# EAGLE design Callisto_MSO_Teknic_v1p00 (EAGLE 9.6.2)
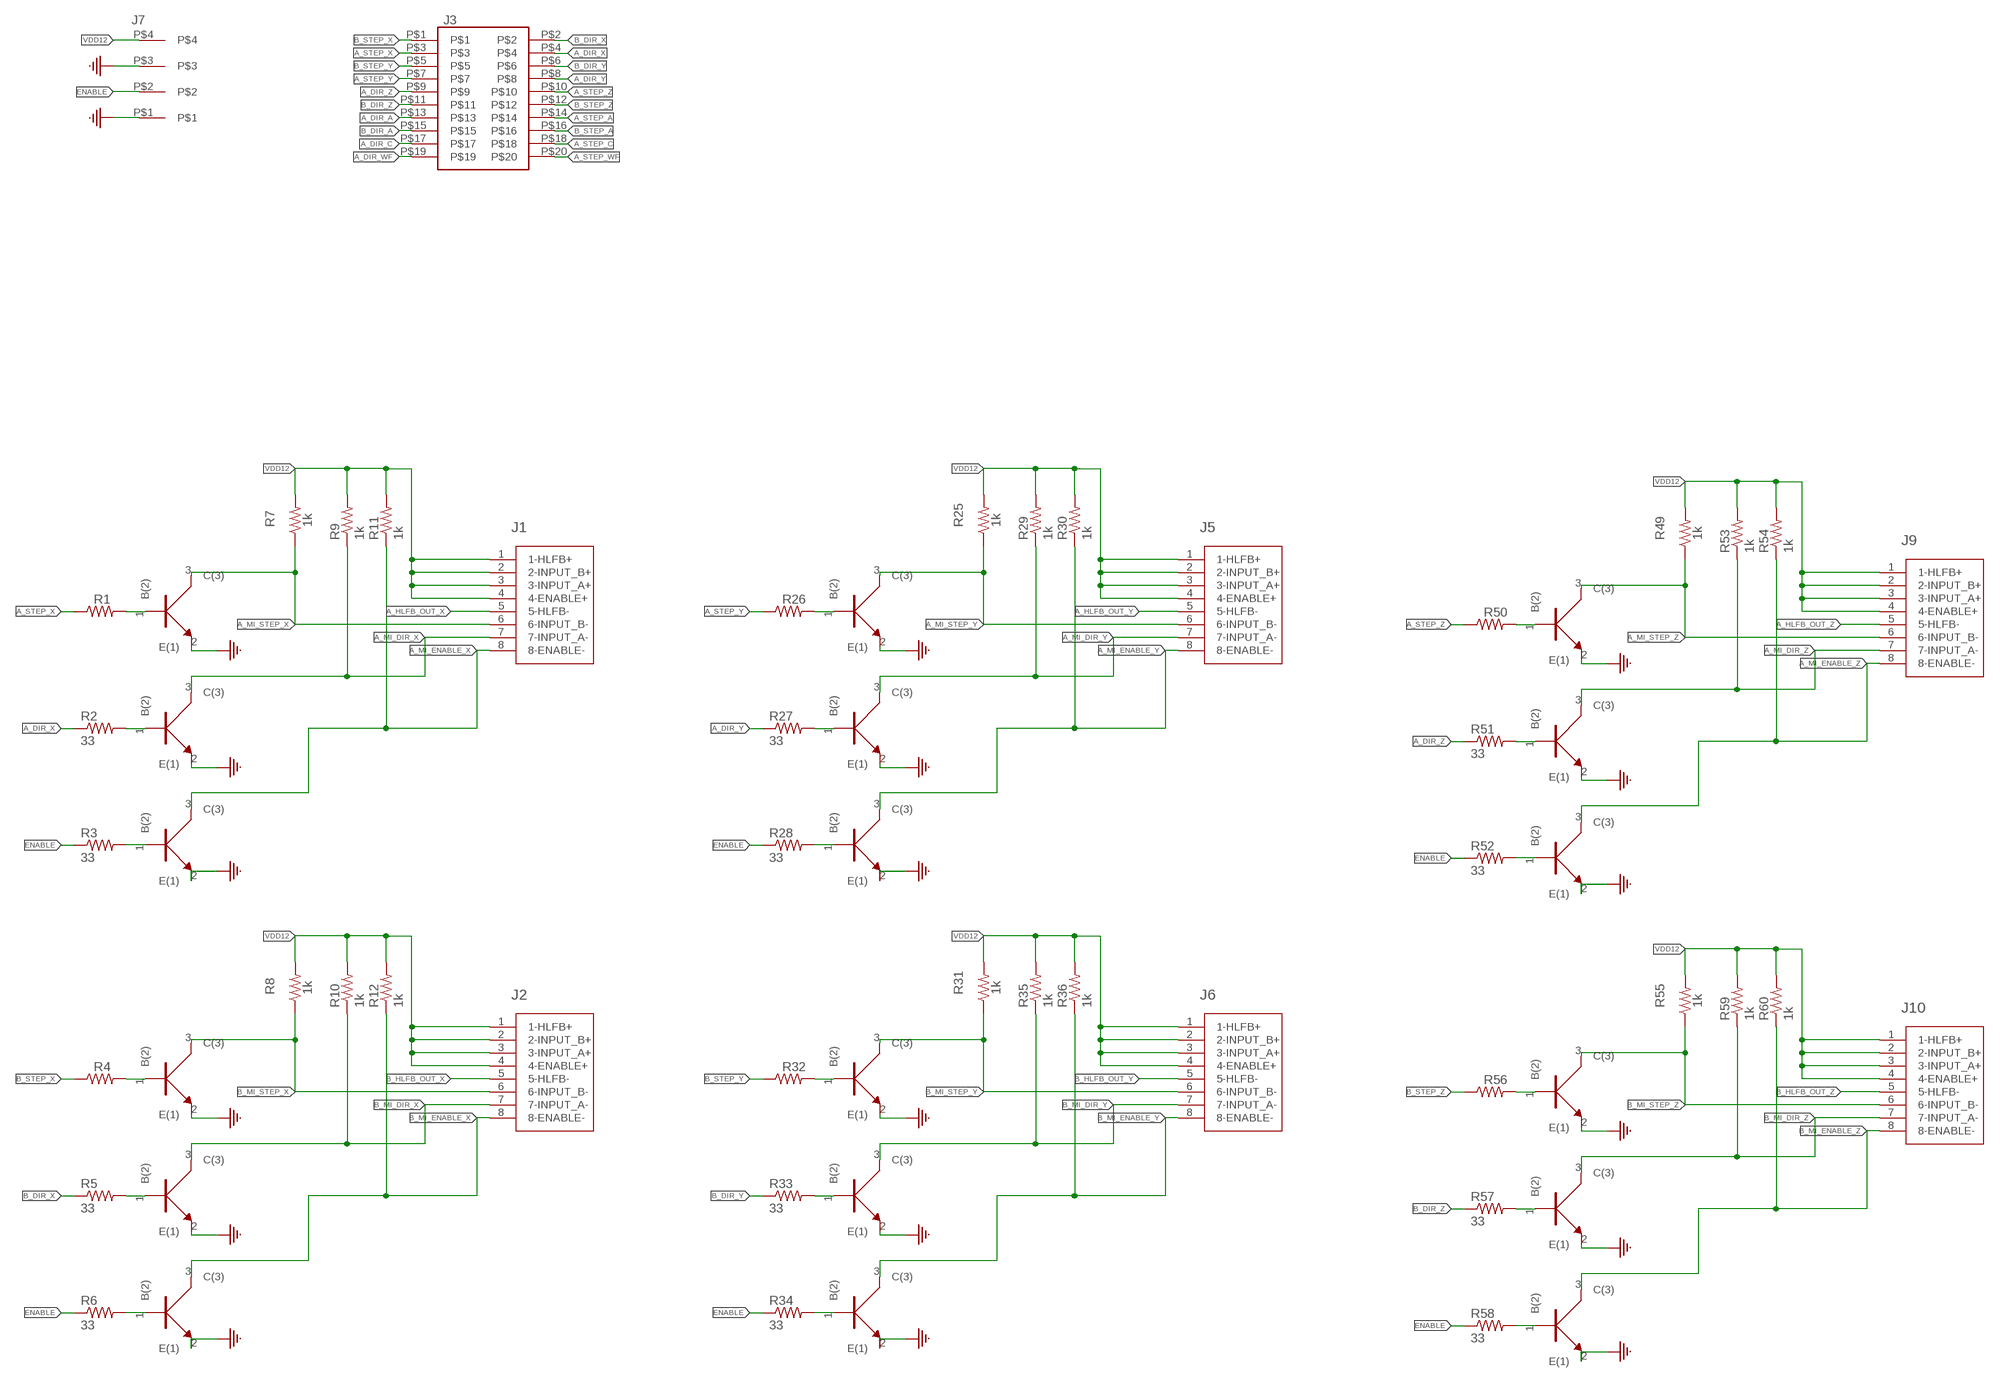
[diagram p0: schematic, sheet 1, part 1 of 2]
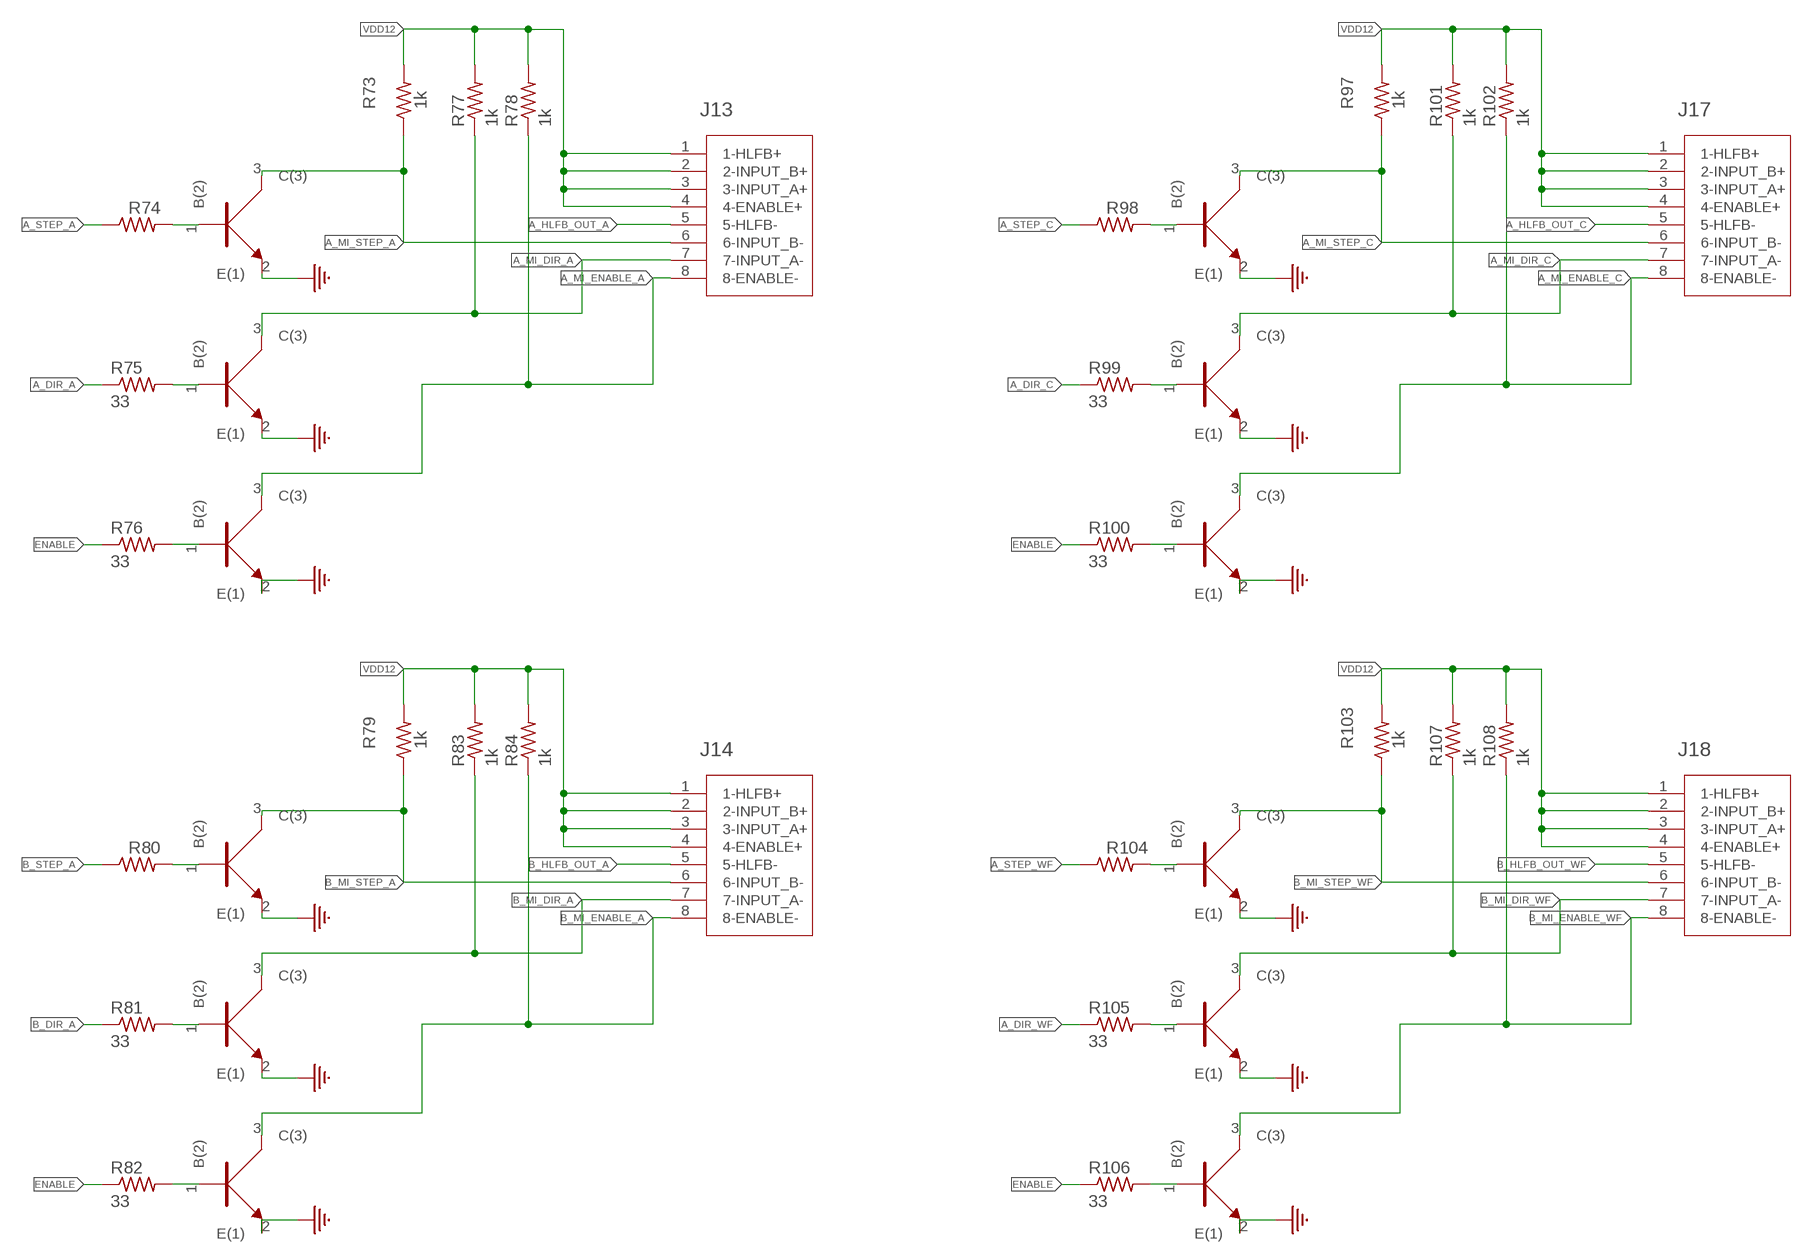
[diagram p1: schematic, sheet 1, part 2 of 2]

## Parts
J1  TEKNIC_8PIN_MOTOR  [CON_39281083]
J2  TEKNIC_8PIN_MOTOR  [CON_39281083]
J3  2_X_10_HEADER_GENERIC2_X_10_.1_IN_RA  [2_X_10_.1_INCH]
J5  TEKNIC_8PIN_MOTOR  [CON_39281083]
J6  TEKNIC_8PIN_MOTOR  [CON_39281083]
J7  4-pos  3.81MM_1_X_4_RT_ANGLE_PLUG_HEADER  [1X4_3.81MM_PITCH]
J9  TEKNIC_8PIN_MOTOR  [CON_39281083]
J10  TEKNIC_8PIN_MOTOR  [CON_39281083]
J13  TEKNIC_8PIN_MOTOR  [CON_39281083]
J14  TEKNIC_8PIN_MOTOR  [CON_39281083]
J17  TEKNIC_8PIN_MOTOR  [CON_39281083]
J18  TEKNIC_8PIN_MOTOR  [CON_39281083]
R1  33  R_0805  [0805]
R2  33  R_0805  [0805]
R3  33  R_0805  [0805]
R4  33  R_0805  [0805]
R5  33  R_0805  [0805]
R6  33  R_0805  [0805]
R7  1k  R_0805  [0805]
R8  1k  R_0805  [0805]
R9  1k  R_0805  [0805]
R10  1k  R_0805  [0805]
R11  1k  R_0805  [0805]
R12  1k  R_0805  [0805]
R25  1k  R_0805  [0805]
R26  33  R_0805  [0805]
R27  33  R_0805  [0805]
R28  33  R_0805  [0805]
R29  1k  R_0805  [0805]
R30  1k  R_0805  [0805]
R31  1k  R_0805  [0805]
R32  33  R_0805  [0805]
R33  33  R_0805  [0805]
R34  33  R_0805  [0805]
R35  1k  R_0805  [0805]
R36  1k  R_0805  [0805]
R49  1k  R_0805  [0805]
R50  33  R_0805  [0805]
R51  33  R_0805  [0805]
R52  33  R_0805  [0805]
R53  1k  R_0805  [0805]
R54  1k  R_0805  [0805]
R55  1k  R_0805  [0805]
R56  33  R_0805  [0805]
R57  33  R_0805  [0805]
R58  33  R_0805  [0805]
R59  1k  R_0805  [0805]
R60  1k  R_0805  [0805]
R73  1k  R_0805  [0805]
R74  33  R_0805  [0805]
R75  33  R_0805  [0805]
R76  33  R_0805  [0805]
R77  1k  R_0805  [0805]
R78  1k  R_0805  [0805]
R79  1k  R_0805  [0805]
R80  33  R_0805  [0805]
R81  33  R_0805  [0805]
R82  33  R_0805  [0805]
R83  1k  R_0805  [0805]
R84  1k  R_0805  [0805]
R97  1k  R_0805  [0805]
R98  33  R_0805  [0805]
R99  33  R_0805  [0805]
R100  33  R_0805  [0805]
R101  1k  R_0805  [0805]
R102  1k  R_0805  [0805]
R103  1k  R_0805  [0805]
R104  33  R_0805  [0805]
R105  33  R_0805  [0805]
R106  33  R_0805  [0805]
R107  1k  R_0805  [0805]
R108  1k  R_0805  [0805]
U1  NPN  BC846BW  [SOT323]
U2  NPN  BC846BW  [SOT323]
U3  NPN  BC846BW  [SOT323]
U4  NPN  BC846BW  [SOT323]
U5  NPN  BC846BW  [SOT323]
U6  NPN  BC846BW  [SOT323]
U13  NPN  BC846BW  [SOT323]
U14  NPN  BC846BW  [SOT323]
U15  NPN  BC846BW  [SOT323]
U16  NPN  BC846BW  [SOT323]
U17  NPN  BC846BW  [SOT323]
U18  NPN  BC846BW  [SOT323]
U25  NPN  BC846BW  [SOT323]
U26  NPN  BC846BW  [SOT323]
U27  NPN  BC846BW  [SOT323]
U28  NPN  BC846BW  [SOT323]
U29  NPN  BC846BW  [SOT323]
U30  NPN  BC846BW  [SOT323]
U37  NPN  BC846BW  [SOT323]
U38  NPN  BC846BW  [SOT323]
U39  NPN  BC846BW  [SOT323]
U40  NPN  BC846BW  [SOT323]
U41  NPN  BC846BW  [SOT323]
U42  NPN  BC846BW  [SOT323]
U49  NPN  BC846BW  [SOT323]
U50  NPN  BC846BW  [SOT323]
U51  NPN  BC846BW  [SOT323]
U52  NPN  BC846BW  [SOT323]
U53  NPN  BC846BW  [SOT323]
U54  NPN  BC846BW  [SOT323]

## Nets
A_DIR_A: J3.P$13 R75.1
A_DIR_C: J3.P$17 R99.1
A_DIR_WF: J3.P$19 R105.1
A_DIR_X: J3.P$4 R2.1
A_DIR_Y: J3.P$8 R27.1
A_DIR_Z: J3.P$9 R51.1
A_HLFB_OUT_A: J13.5(5-HLFB-)
A_HLFB_OUT_C: J17.5(5-HLFB-)
A_HLFB_OUT_X: J1.5(5-HLFB-)
A_HLFB_OUT_Y: J5.5(5-HLFB-)
A_HLFB_OUT_Z: J9.5(5-HLFB-)
A_MI_DIR_A: J13.7(7-INPUT_A-) R77.1 U38.3(C(3))
A_MI_DIR_C: J17.7(7-INPUT_A-) R101.1 U50.3(C(3))
A_MI_DIR_X: J1.7(7-INPUT_A-) R9.1 U2.3(C(3))
A_MI_DIR_Y: J5.7(7-INPUT_A-) R29.1 U14.3(C(3))
A_MI_DIR_Z: J9.7(7-INPUT_A-) R53.1 U26.3(C(3))
A_MI_ENABLE_A: J13.8(8-ENABLE-) R78.1 U39.3(C(3))
A_MI_ENABLE_C: J17.8(8-ENABLE-) R102.1 U51.3(C(3))
A_MI_ENABLE_X: J1.8(8-ENABLE-) R11.1 U3.3(C(3))
A_MI_ENABLE_Y: J5.8(8-ENABLE-) R30.1 U15.3(C(3))
A_MI_ENABLE_Z: J9.8(8-ENABLE-) R54.1 U27.3(C(3))
A_MI_STEP_A: J13.6(6-INPUT_B-) R73.1 U37.3(C(3))
A_MI_STEP_C: J17.6(6-INPUT_B-) R97.1 U49.3(C(3))
A_MI_STEP_X: J1.6(6-INPUT_B-) R7.1 U1.3(C(3))
A_MI_STEP_Y: J5.6(6-INPUT_B-) R25.1 U13.3(C(3))
A_MI_STEP_Z: J9.6(6-INPUT_B-) R49.1 U25.3(C(3))
A_STEP_A: J3.P$14 R74.1
A_STEP_C: J3.P$18 R98.1
A_STEP_WF: J3.P$20 R104.1
A_STEP_X: J3.P$3 R1.1
A_STEP_Y: J3.P$7 R26.1
A_STEP_Z: J3.P$10 R50.1
B_DIR_A: J3.P$15 R81.1
B_DIR_X: J3.P$2 R5.1
B_DIR_Y: J3.P$6 R33.1
B_DIR_Z: J3.P$11 R57.1
B_HLFB_OUT_A: J14.5(5-HLFB-)
B_HLFB_OUT_WF: J18.5(5-HLFB-)
B_HLFB_OUT_X: J2.5(5-HLFB-)
B_HLFB_OUT_Y: J6.5(5-HLFB-)
B_HLFB_OUT_Z: J10.5(5-HLFB-)
B_MI_DIR_A: J14.7(7-INPUT_A-) R83.1 U41.3(C(3))
B_MI_DIR_WF: J18.7(7-INPUT_A-) R107.1 U53.3(C(3))
B_MI_DIR_X: J2.7(7-INPUT_A-) R10.1 U5.3(C(3))
B_MI_DIR_Y: J6.7(7-INPUT_A-) R35.1 U17.3(C(3))
B_MI_DIR_Z: J10.7(7-INPUT_A-) R59.1 U29.3(C(3))
B_MI_ENABLE_A: J14.8(8-ENABLE-) R84.1 U42.3(C(3))
B_MI_ENABLE_WF: J18.8(8-ENABLE-) R108.1 U54.3(C(3))
B_MI_ENABLE_X: J2.8(8-ENABLE-) R12.1 U6.3(C(3))
B_MI_ENABLE_Y: J6.8(8-ENABLE-) R36.1 U18.3(C(3))
B_MI_ENABLE_Z: J10.8(8-ENABLE-) R60.1 U30.3(C(3))
B_MI_STEP_A: J14.6(6-INPUT_B-) R79.1 U40.3(C(3))
B_MI_STEP_WF: J18.6(6-INPUT_B-) R103.1 U52.3(C(3))
B_MI_STEP_X: J2.6(6-INPUT_B-) R8.1 U4.3(C(3))
B_MI_STEP_Y: J6.6(6-INPUT_B-) R31.1 U16.3(C(3))
B_MI_STEP_Z: J10.6(6-INPUT_B-) R55.1 U28.3(C(3))
B_STEP_A: J3.P$16 R80.1
B_STEP_X: J3.P$1 R4.1
B_STEP_Y: J3.P$5 R32.1
B_STEP_Z: J3.P$12 R56.1
ENABLE: J7.P$2 R3.1 R6.1 R28.1 R34.1 R52.1 R58.1 R76.1 R82.1 R100.1 R106.1
GND: J7.P$1 J7.P$3 U1.2(E(1)) U2.2(E(1)) U3.2(E(1)) U4.2(E(1)) U5.2(E(1)) U6.2(E(1)) U13.2(E(1)) U14.2(E(1)) U15.2(E(1)) U16.2(E(1)) U17.2(E(1)) U18.2(E(1)) U25.2(E(1)) U26.2(E(1)) U27.2(E(1)) U28.2(E(1)) U29.2(E(1)) U30.2(E(1)) U37.2(E(1)) U38.2(E(1)) U39.2(E(1)) U40.2(E(1)) U41.2(E(1)) U42.2(E(1)) U49.2(E(1)) U50.2(E(1)) U51.2(E(1)) U52.2(E(1)) U53.2(E(1)) U54.2(E(1))
N$1: R2.2 U2.1(B(2))
N$2: R1.2 U1.1(B(2))
N$4: R3.2 U3.1(B(2))
N$7: R5.2 U5.1(B(2))
N$8: R6.2 U6.1(B(2))
N$9: R4.2 U4.1(B(2))
N$13: R27.2 U14.1(B(2))
N$14: R28.2 U15.1(B(2))
N$15: R26.2 U13.1(B(2))
N$16: R33.2 U17.1(B(2))
N$17: R34.2 U18.1(B(2))
N$18: R32.2 U16.1(B(2))
N$25: R51.2 U26.1(B(2))
N$26: R52.2 U27.1(B(2))
N$27: R50.2 U25.1(B(2))
N$28: R57.2 U29.1(B(2))
N$29: R58.2 U30.1(B(2))
N$30: R56.2 U28.1(B(2))
N$37: R75.2 U38.1(B(2))
N$38: R76.2 U39.1(B(2))
N$39: R74.2 U37.1(B(2))
N$40: R81.2 U41.1(B(2))
N$41: R82.2 U42.1(B(2))
N$42: R80.2 U40.1(B(2))
N$49: R99.2 U50.1(B(2))
N$50: R100.2 U51.1(B(2))
N$51: R98.2 U49.1(B(2))
N$52: R105.2 U53.1(B(2))
N$53: R106.2 U54.1(B(2))
N$54: R104.2 U52.1(B(2))
VDD12: J1.1(1-HLFB+) J1.2(2-INPUT_B+) J1.3(3-INPUT_A+) J1.4(4-ENABLE+) J2.1(1-HLFB+) J2.2(2-INPUT_B+) J2.3(3-INPUT_A+) J2.4(4-ENABLE+) J5.1(1-HLFB+) J5.2(2-INPUT_B+) J5.3(3-INPUT_A+) J5.4(4-ENABLE+) J6.1(1-HLFB+) J6.2(2-INPUT_B+) J6.3(3-INPUT_A+) J6.4(4-ENABLE+) J7.P$4 J9.1(1-HLFB+) J9.2(2-INPUT_B+) J9.3(3-INPUT_A+) J9.4(4-ENABLE+) J10.1(1-HLFB+) J10.2(2-INPUT_B+) J10.3(3-INPUT_A+) J10.4(4-ENABLE+) J13.1(1-HLFB+) J13.2(2-INPUT_B+) J13.3(3-INPUT_A+) J13.4(4-ENABLE+) J14.1(1-HLFB+) J14.2(2-INPUT_B+) J14.3(3-INPUT_A+) J14.4(4-ENABLE+) J17.1(1-HLFB+) J17.2(2-INPUT_B+) J17.3(3-INPUT_A+) J17.4(4-ENABLE+) J18.1(1-HLFB+) J18.2(2-INPUT_B+) J18.3(3-INPUT_A+) J18.4(4-ENABLE+) R7.2 R8.2 R9.2 R10.2 R11.2 R12.2 R25.2 R29.2 R30.2 R31.2 R35.2 R36.2 R49.2 R53.2 R54.2 R55.2 R59.2 R60.2 R73.2 R77.2 R78.2 R79.2 R83.2 R84.2 R97.2 R101.2 R102.2 R103.2 R107.2 R108.2

## Library data of the parts
J1 J2 J5 J6 J9 J10 J13 J14 J17 J18 = 3D_MIG_Controller:TEKNIC_8PIN_MOTOR; COPYRIGHT: Copyright (C) 2022 Ultra Librarian. All rights reserved.; MANUFACTURER_PART_NUMBER: 39281083; MFR_NAME: Molex Connector Corporation
J3 = 3D_MIG_Controller:2_X_10_HEADER_GENERIC: CONN HEADER R/A 20POS 2.54MM, Straight, Right Angle; PARTNO: PH2RA-20-UA
J7 = 3D_MIG_Controller:3.81MM_1_X_4_RT_ANGLE_PLUG_HEADER: 4 Position Terminal Block Header, Male Pins, Shrouded (4 Side) 0.150" (3.81mm) 90°, Right Angle - Through Hole; PARTNO: 691322310004
R1-R12 R25-R36 R49-R60 R73-R84 R97-R108 = 3D_MIG_Controller:R_0805
U1-U6 U13-U18 U25-U30 U37-U42 U49-U54 = 3D_MIG_Controller:BC846BW: Bipolar (BJT) Transistor NPN 100MHz Surface Mount SOT-323; PARTNO: BC846BW_NPN

## Board
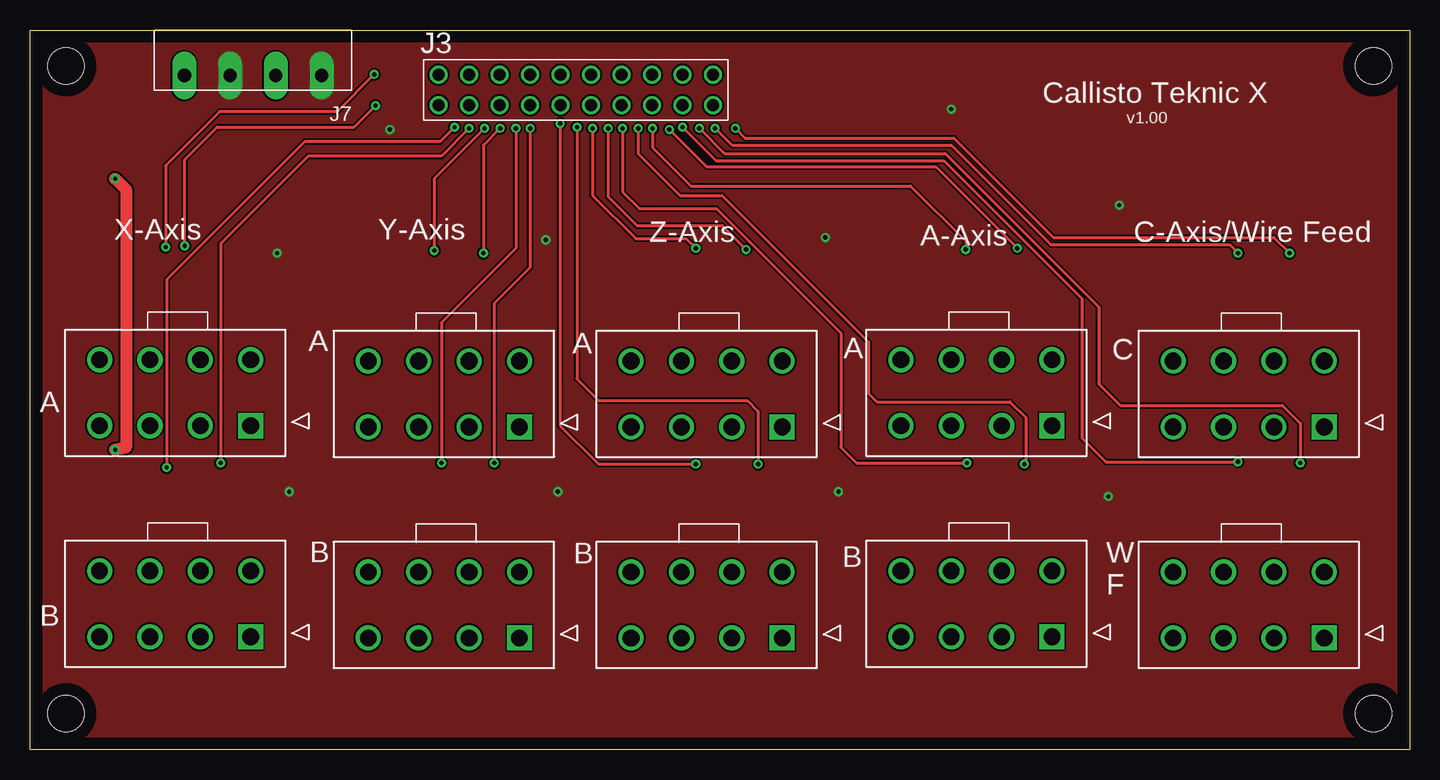
[diagram p2: board, top side]
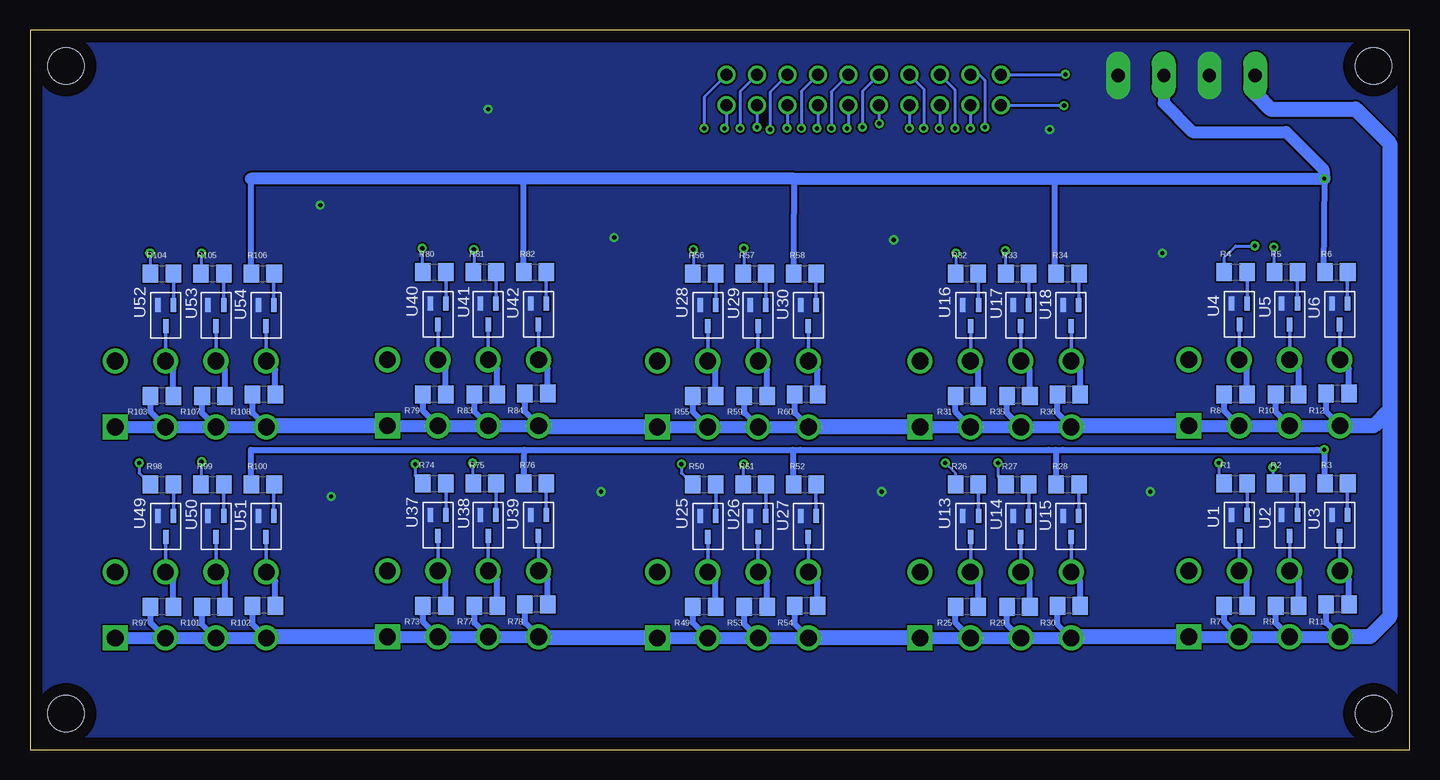
[diagram p3: board, bottom side, seen from below]

Size 115 x 60 mm. Coordinates in mm from the lower left corner, seen from the top.
Outline: 0,0 0,60 115,60 115,0 0,0
Copper layers (1*16): Top 0.035mm / dielectric 1.5mm / Bottom 0.035mm
Design rules "default": minimum track width 6mil, minimum drill 0.35mm, track to track 6mil, track to pad 6mil, pad to pad 6mil, via to via 6mil, smd to smd 6mil, copper to edge 40mil, drill to drill 6mil, minimum pad ring 10mil, minimum via ring 8mil, stop-mask expansion 4mil, vias tented up to drill 0mil, thermal gap 10mil
Holes 3 mm at 3,57 3,3 112,3 112,57

### Footprints (pad centres in the part's own frame; a part is rotated, then mirrored left to right if it is on the bottom)
CON_39281083 = drill 1.397 pad 1.905 square: 1 12.6,-5.5 | drill 1.397 pad 1.905: 2 8.4,-5.5; 3 4.2,-5.5; 4 0,-5.5; 5 12.6,0; 6 8.4,0; 7 4.2,0; 8 0,0
2_X_10_.1_INCH = drill 1: P$1 -11.43,-1.27; P$2 -11.43,1.27; P$3 -8.89,-1.27; P$4 -8.89,1.27; P$5 -6.35,-1.27; P$6 -6.35,1.27; P$7 -3.81,-1.27; P$8 -3.81,1.27; P$9 -1.27,-1.27; P$10 -1.27,1.27; P$11 1.27,-1.27; P$12 1.27,1.27; P$13 3.81,-1.27; P$14 3.81,1.27; P$15 6.35,-1.27; P$16 6.35,1.27; P$17 8.89,-1.27; P$18 8.89,1.27; P$19 11.43,-1.27; P$20 11.43,1.27
1X4_3.81MM_PITCH = drill 1.1 pad 2 long: P$1 0,0; P$2 3.81,0; P$3 7.62,0; P$4 11.43,0
0805 = smd 1.3 x 1.5: 1 -0.95,0; 2 0.95,0
SOT323 = smd 0.457 x 1.168: 1 -0.65,-0.876; 2 0.65,-0.876; 3 0,0.876

### Placement (x,y rotation side)
J1  5.8,14.9 0 top
J2  5.8,32.5 0 top
J3  45.5,55 0 top
J5  28.2,14.8 0 top
J6  28.2,32.4 0 top
J7  24.3,56.2 180 top
J9  50.1,14.8 0 top
J10  50.1,32.4 0 top
J13  72.6,14.9 0 top
J14  72.6,32.5 0 top
J17  95.3,14.8 0 top
J18  95.3,32.4 0 top
R1  14.5,22.2 0 bottom
R2  10.3,22.2 0 bottom
R3  6.1,22.2 0 bottom
R4  14.5,39.8 0 bottom
R5  10.3,39.8 0 bottom
R6  6.1,39.8 0 bottom
R7  14.5,12 180 bottom
R8  14.5,29.6 180 bottom
R9  10.2,12 180 bottom
R10  10.2,29.6 180 bottom
R11  6,12.1 180 bottom
R12  6,29.7 180 bottom
R25  36.9,11.9 180 bottom
R26  36.9,22.1 0 bottom
R27  32.7,22.1 0 bottom
R28  28.5,22.1 0 bottom
R29  32.6,11.9 180 bottom
R30  28.4,12 180 bottom
R31  36.9,29.5 180 bottom
R32  36.9,39.7 0 bottom
R33  32.7,39.7 0 bottom
R34  28.5,39.7 0 bottom
R35  32.6,29.5 180 bottom
R36  28.4,29.6 180 bottom
R49  58.8,11.9 180 bottom
R50  58.8,22.1 0 bottom
R51  54.6,22.1 0 bottom
R52  50.4,22.1 0 bottom
R53  54.5,11.9 180 bottom
R54  50.3,12 180 bottom
R55  58.8,29.5 180 bottom
R56  58.8,39.7 0 bottom
R57  54.6,39.7 0 bottom
R58  50.4,39.7 0 bottom
R59  54.5,29.5 180 bottom
R60  50.3,29.6 180 bottom
R73  81.3,12 180 bottom
R74  81.3,22.2 0 bottom
R75  77.1,22.2 0 bottom
R76  72.9,22.2 0 bottom
R77  77,12 180 bottom
R78  72.8,12.1 180 bottom
R79  81.3,29.6 180 bottom
R80  81.3,39.8 0 bottom
R81  77.1,39.8 0 bottom
R82  72.9,39.8 0 bottom
R83  77,29.6 180 bottom
R84  72.8,29.7 180 bottom
R97  104,11.9 180 bottom
R98  104,22.1 0 bottom
R99  99.8,22.1 0 bottom
R100  95.6,22.1 0 bottom
R101  99.7,11.9 180 bottom
R102  95.5,12 180 bottom
R103  104,29.5 180 bottom
R104  104,39.7 0 bottom
R105  99.8,39.7 0 bottom
R106  95.6,39.7 0 bottom
R107  99.7,29.5 180 bottom
R108  95.5,29.6 180 bottom
U1  14.18,18.7 180 bottom
U2  10,18.7 180 bottom
U3  5.82,18.7 180 bottom
U4  14.18,36.3 180 bottom
U5  10,36.3 180 bottom
U6  5.82,36.3 180 bottom
U13  36.58,18.6 180 bottom
U14  32.4,18.6 180 bottom
U15  28.22,18.6 180 bottom
U16  36.58,36.2 180 bottom
U17  32.4,36.2 180 bottom
U18  28.22,36.2 180 bottom
U25  58.48,18.6 180 bottom
U26  54.3,18.6 180 bottom
U27  50.12,18.6 180 bottom
U28  58.48,36.2 180 bottom
U29  54.3,36.2 180 bottom
U30  50.12,36.2 180 bottom
U37  80.98,18.7 180 bottom
U38  76.8,18.7 180 bottom
U39  72.62,18.7 180 bottom
U40  80.98,36.3 180 bottom
U41  76.8,36.3 180 bottom
U42  72.62,36.3 180 bottom
U49  103.68,18.6 180 bottom
U50  99.5,18.6 180 bottom
U51  95.32,18.6 180 bottom
U52  103.68,36.2 180 bottom
U53  99.5,36.2 180 bottom
U54  95.32,36.2 180 bottom

### Tracks (layer width: path | path; a pad name or v marks a point on that pad's centre or on a via)
A_DIR_A  (via drill 0.35)
  Top 0.254: v49.4,51.8 49.4,46.5 50.8,45.1 57.23,45.1 67.6,34.73 67.6,25.2 68.9,23.9 v78.1,23.9
  Bottom 0.254: J3.P$13 49.31,51.89 v49.4,51.8 | v78.1,23.9 78.1,22.25 R75.1
A_DIR_C  (via drill 0.35)
  Top 0.254: v54.4,51.9 57.2,49.1 76.2,49.1 87.7,37.6 87.7,26 89.7,24 v100.7,24
  Bottom 0.254: J3.P$17 v54.4,51.9 | v100.7,24 100.75,23.95 R99.1
A_DIR_WF  (via drill 0.35)
  Top 0.254: v57.1,51.8 58.5,50.4 76.8,50.4 85.1,42.1 100,42.1 v100.7,41.4
  Bottom 0.254: J3.P$19 56.93,51.97 v57.1,51.8 | v100.7,41.4 100.75,41.35 R105.1
A_DIR_X  (via drill 0.35)
  Top 0.254: v35.4,51.9 34.2,50.7 22.9,50.7 11.4,39.2 v11.4,23.52
  Bottom 0.254: J3.P$4 35.87,56.27 35.4,55.8 v35.4,51.9 | v11.4,23.52 11.4,22.35 R2.1
A_DIR_Y  (via drill 0.35)
  Top 0.254: v40.5,51.8 40.5,41.8 34.3,35.6 v34.3,23.9
  Bottom 0.254: J3.P$8 40.5,55.08 v40.5,51.8 | v34.3,23.9 34.3,22.75 R27.1
A_DIR_Z  (via drill 0.35)
  Top 0.254: v44.2,52.2 44.2,27 47.4,23.8 v55.5,23.8
  Bottom 0.254: J3.P$9 44.23,52.23 v44.2,52.2 | v55.5,23.8 55.55,23.75 R51.1
A_MI_DIR_A
  Bottom 0.305: U38.3 J13.7
  Bottom 0.508: R77.1 76.05,14.15 J13.7
A_MI_DIR_C
  Bottom 0.305: U50.3 J17.7
  Bottom 0.508: R101.1 98.75,14.05 J17.7
A_MI_DIR_X
  Bottom 0.305: U2.3 J1.7
  Bottom 0.508: R9.1 9.25,14.15 J1.7
A_MI_DIR_Y
  Bottom 0.305: U14.3 J5.7
  Bottom 0.508: R29.1 31.65,14.05 J5.7
A_MI_DIR_Z
  Bottom 0.305: U26.3 J9.7
  Bottom 0.508: R53.1 53.55,14.05 J9.7
A_MI_ENABLE_A
  Bottom 0.305: J13.8 72.6,17.8 U39.3
  Bottom 0.508: R78.1 71.85,14.15 J13.8
A_MI_ENABLE_C
  Bottom 0.305: J17.8 95.3,17.7 U51.3
  Bottom 0.508: R102.1 94.55,14.05 J17.8
A_MI_ENABLE_X
  Bottom 0.305: J1.8 5.8,17.8 U3.3
  Bottom 0.508: R11.1 5.05,14.15 J1.8
A_MI_ENABLE_Y
  Bottom 0.305: J5.8 28.2,17.7 U15.3
  Bottom 0.508: R30.1 27.45,14.05 J5.8
A_MI_ENABLE_Z
  Bottom 0.305: J9.8 50.1,17.7 U27.3
  Bottom 0.508: R54.1 49.35,14.05 J9.8
A_MI_STEP_A
  Bottom 0.305: U37.3 80.98,14.92 J13.6
  Bottom 0.508: R73.1 80.35,14.25 J13.6
A_MI_STEP_C
  Bottom 0.305: U49.3 103.68,14.82 J17.6
  Bottom 0.508: R97.1 103.05,14.15 J17.6
A_MI_STEP_X
  Bottom 0.305: U1.3 14.18,14.92 J1.6
  Bottom 0.508: R7.1 13.55,14.25 J1.6
A_MI_STEP_Y
  Bottom 0.305: U13.3 36.58,14.82 J5.6
  Bottom 0.508: R25.1 35.95,14.15 J5.6
A_MI_STEP_Z
  Bottom 0.305: U25.3 58.48,14.82 J9.6
  Bottom 0.508: R49.1 57.85,14.15 J9.6
A_STEP_A  (via drill 0.35)
  Top 0.254: v50.7,51.8 50.7,49.7 54.2,46.2 57.7,46.2 69.9,34 69.9,29.7 70.6,29 81.7,29 83,27.7 83,23.9 v82.9,23.8
  Bottom 0.254: J3.P$14 50.7,54.88 v50.7,51.8 | v82.9,23.8 82.9,22.85 R74.1
A_STEP_C  (via drill 0.35)
  Top 0.254: v55.8,51.8 57.9,49.7 76.3,49.7 89.1,36.9 89.1,30.5 90.9,28.7 104.4,28.7 105.9,27.2 v105.9,23.9
  Bottom 0.254: J3.P$18 55.8,54.86 v55.8,51.8 | v105.9,23.9 105.9,23.05 R98.1
A_STEP_WF  (via drill 0.35)
  Top 0.254: v58.8,51.8 59.6,51 77,51 85.3,42.7 103.7,42.7 v105,41.4
  Bottom 0.254: J3.P$20 58.8,54.4 v58.8,51.8 | v105,41.4 105,39.75 R104.1
A_STEP_X  (via drill 0.35)
  Top 0.254: v36.6,51.8 34.3,49.5 23.2,49.5 15.9,42.2 v15.9,23.9
  Bottom 0.254: J3.P$3 v36.61,51.81 v36.6,51.8 | v15.9,23.9 15.9,22.65 R1.1
A_STEP_Y  (via drill 0.35)
  Top 0.254: v41.7,51.8 41.7,40.2 38.7,37.2 v38.7,23.9
  Bottom 0.254: J3.P$7 v41.69,51.81 v41.7,51.8 | v38.7,23.9 37.85,23.05 R26.1
A_STEP_Z  (via drill 0.35)
  Top 0.254: v45.6,51.9 45.6,30.9 47.4,29.1 59.8,29.1 60.7,28.2 v60.7,23.8
  Bottom 0.254: J3.P$10 45.6,54.9 v45.6,51.9 | v60.7,23.8 60.7,23.05 R50.1
B_DIR_A  (via drill 0.35)
  Top 0.254: v51.9,51.8 51.9,50.2 55.1,47 73.4,47 78,42.4 v78,41.7
  Bottom 0.254: J3.P$15 51.85,51.85 v51.9,51.8 | v78,41.7 78,39.85 R81.1
B_DIR_X  (via drill 0.35)
  Top 0.254: v28.7,56.3 25.6,53.2 15.8,53.2 11.3,48.7 v11.3,41.9
  Bottom 0.254: J3.P$2 28.73,56.27 v28.7,56.3 | v11.3,41.9 11.3,39.85 R5.1
B_DIR_Y  (via drill 0.35)
  Top 0.254: v37.9,51.8 33.7,47.6 v33.7,41.6
  Bottom 0.254: J3.P$6 37.9,55.02 v37.9,51.8 | v33.7,41.6 33.7,39.75 R33.1
B_DIR_Z  (via drill 0.35)
  Top 0.254: v46.9,51.8 46.9,46.2 50.5,42.6 54.7,42.6 v55.5,41.8
  Bottom 0.254: 55.6,39.75 R57.1 55.5,39.75 v55.5,41.8 | J3.P$11 46.77,51.93 v46.9,51.8
B_MI_DIR_A
  Bottom 0.305: U41.3 J14.7
  Bottom 0.508: R83.1 76.05,31.75 J14.7
B_MI_DIR_WF
  Bottom 0.305: U53.3 J18.7
  Bottom 0.508: R107.1 98.75,31.65 J18.7
B_MI_DIR_X
  Bottom 0.305: U5.3 J2.7
  Bottom 0.508: R10.1 9.25,31.75 J2.7
B_MI_DIR_Y
  Bottom 0.305: U17.3 J6.7
  Bottom 0.508: R35.1 31.65,31.65 J6.7
B_MI_DIR_Z
  Bottom 0.305: U29.3 J10.7
  Bottom 0.508: R59.1 53.55,31.65 J10.7
B_MI_ENABLE_A
  Bottom 0.305: J14.8 72.6,35.4 U42.3
  Bottom 0.508: R84.1 71.85,31.75 J14.8
B_MI_ENABLE_WF
  Bottom 0.305: J18.8 95.3,35.3 U54.3
  Bottom 0.508: R108.1 94.55,31.65 J18.8
B_MI_ENABLE_X
  Bottom 0.305: J2.8 5.8,35.4 U6.3
  Bottom 0.508: R12.1 5.05,31.75 J2.8
B_MI_ENABLE_Y
  Bottom 0.305: J6.8 28.2,35.3 U18.3
  Bottom 0.508: R36.1 27.45,31.65 J6.8
B_MI_ENABLE_Z
  Bottom 0.305: J10.8 50.1,35.3 U30.3
  Bottom 0.508: R60.1 49.35,31.65 J10.8
B_MI_STEP_A
  Bottom 0.305: U40.3 80.98,32.52 J14.6
  Bottom 0.508: R79.1 80.35,31.85 J14.6
B_MI_STEP_WF
  Bottom 0.305: U52.3 103.68,32.42 J18.6
  Bottom 0.508: R103.1 103.05,31.75 J18.6
B_MI_STEP_X
  Bottom 0.305: U4.3 14.18,32.52 J2.6
  Bottom 0.508: R8.1 13.55,31.85 J2.6
B_MI_STEP_Y
  Bottom 0.305: U16.3 36.58,32.42 J6.6
  Bottom 0.508: R31.1 35.95,31.75 J6.6
B_MI_STEP_Z
  Bottom 0.305: U28.3 58.48,32.42 J10.6
  Bottom 0.508: R55.1 57.85,31.75 J10.6
B_STEP_A  (via drill 0.35)
  Top 0.254: v53.3,51.7 56.4,48.6 75.5,48.6 v82.3,41.8
  Bottom 0.254: J3.P$16 53.3,54.82 v53.3,51.7 | v82.3,41.8 82.3,39.85 R80.1
B_STEP_X  (via drill 0.35)
  Top 0.254: v12.9,42 12.9,49.2 15.6,51.9 27,51.9 v28.8,53.7
  Bottom 0.254: v12.9,42 14.5,42 15.45,41.05 R4.1 | v28.8,53.7 34.04,53.7 J3.P$1
B_STEP_Y  (via drill 0.35)
  Top 0.254: v39.2,51.8 37.8,50.4 v37.8,41.4
  Bottom 0.254: J3.P$5 39.15,51.85 v39.2,51.8 | v37.8,41.4 37.8,39.75 R32.1
B_STEP_Z  (via drill 0.35)
  Top 0.254: v48.2,51.8 48.2,46.1 50.6,43.7 57.7,43.7 v59.7,41.7
  Bottom 0.254: R56.1 59.8,39.75 59.7,39.85 v59.7,41.7 | J3.P$12 48.2,54.84 v48.2,51.8
ENABLE  (via drill 0.35)
  Top 1.016: v7.1,25 8,25.2 8,46.7 v7.1,47.6
  Bottom 0.508: v7.1,47.6 7.2,39.95 R6.1 | 29.6,47.6 29.6,39.85 R34.1 | R58.1 51.35,41.75 51.3,47.6 | 73.9,47.6 73.9,39.85 R82.1 | 96.6,47.6 96.6,39.75 R106.1 | R3.1 7.1,22.25 v7.1,25 7.7,25 28.9,25 29.5,25 | 29.5,25 29.5,22.15 R28.1 | 51.4,25 51.4,22.15 R52.1 | 73.8,25 73.85,24.25 R76.1 | R100.1 96.6,22.15 96.6,25 73.8,25 | 73.8,25 51.4,25 | 51.4,25 50.8,25 30.1,25 29.5,25
  Bottom 1.016: J7.P$2 20.49,53.9 18.09,51.5 10.29,51.5 7.2,48.41 v7.1,47.6 29.6,47.6 51.3,47.6 73.9,47.6 96.6,47.6
GND  (via drill 0.35)
  other vias: 20.6,41.4 30,51.7 76.8,53.4 66.3,42.7 21.6,21.5 44,21.5 67.4,21.5 89.9,21.1 43,42.5 90.8,45.4
  pour Bottom (no thermals): 0,0 0,60 115,60 115,0
  pour Top (no thermals): 0,0 0,60 115,60 115,0
N$1
  Bottom 0.305: U2.1 R2.2
N$2
  Bottom 0.305: U1.1 13.53,22.18 R1.2
N$4
  Bottom 0.305: U3.1 5.17,22.18 R3.2
N$7
  Bottom 0.305: U5.1 R5.2
N$8
  Bottom 0.305: U6.1 5.17,39.78 R6.2
N$9
  Bottom 0.305: U4.1 13.53,39.78 R4.2
N$13
  Bottom 0.305: U14.1 R27.2
N$14
  Bottom 0.305: U15.1 27.57,22.08 R28.2
N$15
  Bottom 0.305: U13.1 35.93,22.08 R26.2
N$16
  Bottom 0.305: U17.1 R33.2
N$17
  Bottom 0.305: U18.1 27.57,39.68 R34.2
N$18
  Bottom 0.305: U16.1 35.93,39.68 R32.2
N$25
  Bottom 0.305: U26.1 R51.2
N$26
  Bottom 0.305: U27.1 49.47,22.08 R52.2
N$27
  Bottom 0.305: U25.1 57.83,22.08 R50.2
N$28
  Bottom 0.305: U29.1 R57.2
N$29
  Bottom 0.305: U30.1 49.47,39.68 R58.2
N$30
  Bottom 0.305: U28.1 57.83,39.68 R56.2
N$37
  Bottom 0.305: U38.1 R75.2
N$38
  Bottom 0.305: U39.1 71.97,22.18 R76.2
N$39
  Bottom 0.305: U37.1 80.33,22.18 R74.2
N$40
  Bottom 0.305: U41.1 R81.2
N$41
  Bottom 0.305: U42.1 71.97,39.78 R82.2
N$42
  Bottom 0.305: U40.1 80.33,39.78 R80.2
N$49
  Bottom 0.305: U50.1 R99.2
N$50
  Bottom 0.305: U51.1 94.67,22.08 R100.2
N$51
  Bottom 0.305: U49.1 103.03,22.08 R98.2
N$52
  Bottom 0.305: U53.1 R105.2
N$53
  Bottom 0.305: U54.1 94.67,39.68 R106.2
N$54
  Bottom 0.305: U52.1 103.03,39.68 R104.2
VDD12
  Bottom 0.508: J1.4 6.95,10.55 R11.2 | J1.3 11.15,10.55 R9.2 | J1.2 15.45,10.65 R7.2 | J2.4 6.95,28.15 R12.2 | J2.3 11.15,28.15 R10.2 | J2.2 15.45,28.25 R8.2 | J5.4 29.35,10.45 R30.2 | J5.3 33.55,10.45 R29.2 | J5.2 37.85,10.55 R25.2 | J6.4 29.35,28.05 R36.2 | J6.3 33.55,28.05 R35.2 | J6.2 37.85,28.15 R31.2 | J9.4 51.25,10.45 R54.2 | J9.3 55.45,10.45 R53.2 | J9.2 59.75,10.55 R49.2 | J10.4 51.25,28.05 R60.2 | J10.3 55.45,28.05 R59.2 | J10.2 59.75,28.15 R55.2 | J13.4 73.75,10.55 R78.2 | J13.3 77.95,10.55 R77.2 | J13.2 82.25,10.65 R73.2 | J14.4 73.75,28.15 R84.2 | J14.3 77.95,28.15 R83.2 | J14.2 82.25,28.25 R79.2 | J17.4 96.45,10.45 R102.2 | J17.3 100.65,10.45 R101.2 | J17.2 104.95,10.55 R97.2 | J18.4 95.6,27.2 96.45,28.05 R108.2 | J18.3 100.65,28.05 R107.2 | J18.2 104.95,28.15 R103.2
  Bottom 1.016: J1.1 J1.2 J1.3 J1.4 | J2.1 J2.2 J2.3 J2.4 | J5.1 J5.2 J5.3 J5.4 | J6.1 J6.2 J6.3 J6.4 | J9.1 J9.2 J9.3 J9.4 | J10.1 J10.2 J10.3 J10.4 | J13.1 J13.2 J13.3 J13.4 | J14.1 J14.2 J14.3 J14.4 | J17.1 J17.2 J17.3 J17.4 | J18.1 J18.2 J18.3 J18.4
  Bottom 1.27: 1.65,28.35 1.65,50.55 4.5,53.4 11.6,53.4 12.87,54.67 J7.P$4 | J2.4 3,27 1.65,28.35 | 1.65,28.35 1.65,11.05 3.3,9.4 J1.4 | J2.1 28.1,27 J6.4 | J6.1 J10.4 | J10.1 72.5,26.9 J14.4 | J14.1 95.4,27 95.6,27.2 | J1.1 28.1,9.4 J5.4 | J5.1 J9.4 | J9.1 72.5,9.3 J13.4 | J13.1 95.2,9.4 J17.4

### Text on the board
tNames: Callisto Teknic X | v1.00 | X-Axis | Y-Axis | Z-Axis | A-Axis | C-Axis/Wire Feed | A | A | A | C | A | B | B | B | W / F | B